# EAGLE design zLineIn_v.0.3a (EAGLE 6.5.0)
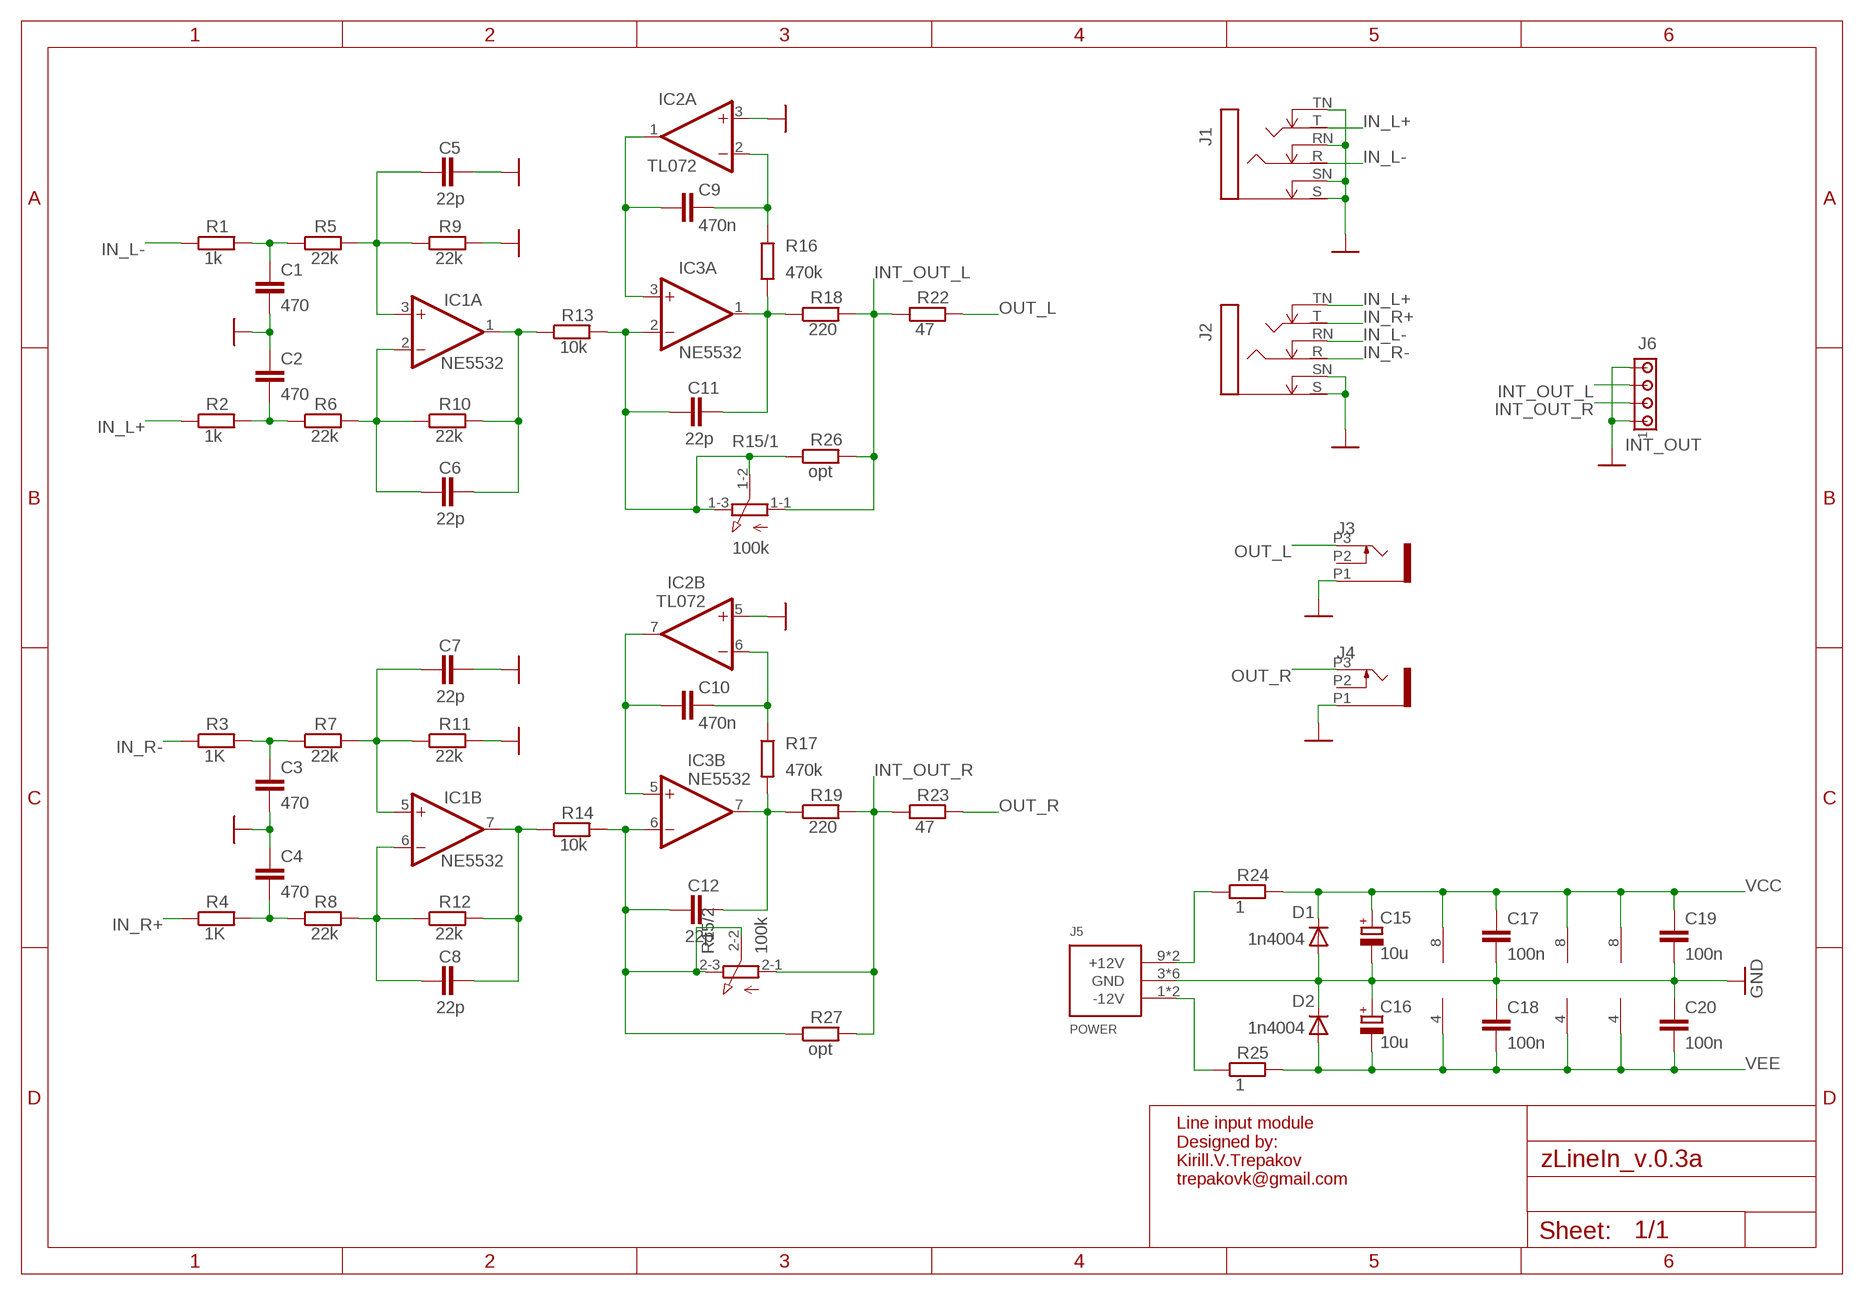
[diagram p0: schematic, sheet 1]

## Parts
C1  470  C-EU050-024X044  [C050-024X044]
C2  470  C-EU050-024X044  [C050-024X044]
C3  470  C-EU050-024X044  [C050-024X044]
C4  470  C-EU050-024X044  [C050-024X044]
C5  22p  C-EU050-024X044  [C050-024X044]
C6  22p  C-EU050-024X044  [C050-024X044]
C7  22p  C-EU050-024X044  [C050-024X044]
C8  22p  C-EU050-024X044  [C050-024X044]
C9  470n  C-EU075-032X103  [C075-032X103]
C10  470n  C-EU075-032X103  [C075-032X103]
C11  22p  C-EU050-024X044  [C050-024X044]
C12  22p  C-EU050-024X044  [C050-024X044]
C15  10u  CPOL-EUE2.5-5  [E2,5-5]
C16  10u  CPOL-EUE2.5-5  [E2,5-5]
C17  100n  C-EU050-024X044  [C050-024X044]
C18  100n  C-EU050-024X044  [C050-024X044]
C19  100n  C-EU050-024X044  [C050-024X044]
C20  100n  C-EU050-024X044  [C050-024X044]
D1  1n4004  1N4004"  [DO41-7.6]
D2  1n4004  1N4004"  [DO41-7.6]
IC1  NE5532  TL072P_  [DIL08_]
IC2  TL072  TL072P_  [DIL08_]
IC3  NE5532  TL072P_  [DIL08_]
J1  IN_L  STEREOSW1  [NMJ6HC-S]
J2  IN_R  STEREOSW1  [NMJ6HC-S]
J3  WQP-PJ302M_JACK  [WQP-PJ302M_JACK]
J4  WQP-PJ302M_JACK  [WQP-PJ302M_JACK]
J5  POWER  POWER_SIMPLE10  [POWER_10]
J6  INT_OUT  MTA04-100  [10X04MTA]
R1  1k  R-EU_0204/7  [0204/7]
R2  1k  R-EU_0204/7  [0204/7]
R3  1K  R-EU_0204/7  [0204/7]
R4  1K  R-EU_0204/7  [0204/7]
R5  22k  R-EU_0204/7  [0204/7]
R6  22k  R-EU_0204/7  [0204/7]
R7  22k  R-EU_0204/7  [0204/7]
R8  22k  R-EU_0204/7  [0204/7]
R9  22k  R-EU_0204/7  [0204/7]
R10  22k  R-EU_0204/7  [0204/7]
R11  22k  R-EU_0204/7  [0204/7]
R12  22k  R-EU_0204/7  [0204/7]
R13  10k  R-EU_0204/7  [0204/7]
R14  10k  R-EU_0204/7  [0204/7]
R15  100k  3RP/1610G  [3RP/1610G]
R16  470k  R-EU_0204/7  [0204/7]
R17  470k  R-EU_0204/7  [0204/7]
R18  220  R-EU_0204/7  [0204/7]
R19  220  R-EU_0204/7  [0204/7]
R22  47  R-EU_0204/7  [0204/7]
R23  47  R-EU_0204/7  [0204/7]
R24  1  R-EU_0204/7  [0204/7]
R25  1  R-EU_0204/7  [0204/7]
R26  opt  R-EU_0204/7  [0204/7]
R27  opt  R-EU_0204/7  [0204/7]

## Nets
CTRL_L_OUT: C11.2 IC3.1(A:OUT) R16.2 R18.1
CTRL_R_OUT: C12.2 IC3.7(B:OUT) R17.2 R19.1
GND: C1.2 C2.1 C3.2 C4.1 C5.2 C7.2 C15.- C16.+ C17.2 C18.1 C19.2 C20.1 D1.A D2.C IC2.3(A:+IN) IC2.5(B:+IN) J1.RN J1.S J1.SN J1.TN J2.S J2.SN J3.P1 J4.P1 J5.3(GND) J5.4(GND) J5.5(GND) J5.6(GND) J5.7(GND) J5.8(GND) J6.1 J6.4 R9.2 R11.2
IN_L+: J1.T J2.TN R2.1
IN_L-: J1.R J2.RN R1.1
IN_R+: J2.T R4.1
IN_R-: J2.R R3.1
INT_OUT_L: J6.3 R15.1-1 R18.2 R22.1 R26.2
INT_OUT_R: J6.2 R15.2-1 R19.2 R23.1 R27.2
N$2: J5.9(+12V) J5.10(+12V) R24.1
N$3: C9.2 IC2.2(A:-IN) R16.1
N$5: C10.2 IC2.6(B:-IN) R17.1
N$6: J5.1(-12V) J5.2(-12V) R25.1
N$7: C3.1 R3.2 R7.1
N$9: C4.2 R4.2 R8.1
N$17: C7.1 IC1.5(B:+IN) R7.2 R11.1
N$19: C1.1 R1.2 R5.1
N$20: C2.2 R2.2 R6.1
N$22: C5.1 IC1.3(A:+IN) R5.2 R9.1
N$23: C6.1 IC1.2(A:-IN) R6.2 R10.1
N$25: C8.1 IC1.6(B:-IN) R8.2 R12.1
OFFSET_L: C9.1 IC2.1(A:OUT) IC3.3(A:+IN)
OFFSET_R: C10.1 IC2.7(B:OUT) IC3.5(B:+IN)
OUT_L: J3.P3 R22.2
OUT_R: J4.P3 R23.2
UNBAL_L: C6.2 IC1.1(A:OUT) R10.2 R13.1
UNBAL_R: C8.2 IC1.7(B:OUT) R12.2 R14.1
VCC: C15.+ C17.1 C19.1 D1.C IC1.8(P:V+) IC2.8(P:V+) IC3.8(P:V+) R24.2
VEE: C16.- C18.2 C20.2 D2.A IC1.4(P:V-) IC2.4(P:V-) IC3.4(P:V-) R25.2
VGND_L: C11.1 IC3.2(A:-IN) R13.2 R15.1-2 R15.1-3 R26.1
VGND_R: C12.1 IC3.6(B:-IN) R14.2 R15.2-2 R15.2-3 R27.1
Unconnected: J3.P2 J4.P2

## Notes on the sheet
- Line input module
  Designed by:
  Kirill.V.Trepakov
  trepakovk@gmail.com

## Library data of the parts
C1-C12 C17-C20 = rcl:C-EU: CAPACITOR, European symbol
C15 C16 = rcl:CPOL-EU: POLARIZED CAPACITOR, European symbol
D1 D2 = _motovilo:1N4004: DIODE general purpose rectifier, 1 A
IC1-IC3 = _motovilo:TL072: OP AMP
J1 J2 = _motovilo:STEREOSW
J3 J4 = _motovilo:WQP-PJ302M_JACK
J5 = _motovilo:POWER_SIMPLE
J6 = con-amp:MTA04-100: AMP connector
R1-R14 R16-R19 R22-R27 = rcl:R-EU_: RESISTOR, European symbol
R15 = _motovilo:3RP/1610G: 16mm Potentiometer two level Source: http://www.alphapotentiometers.net/html/16mm_pot_2.html

## Board
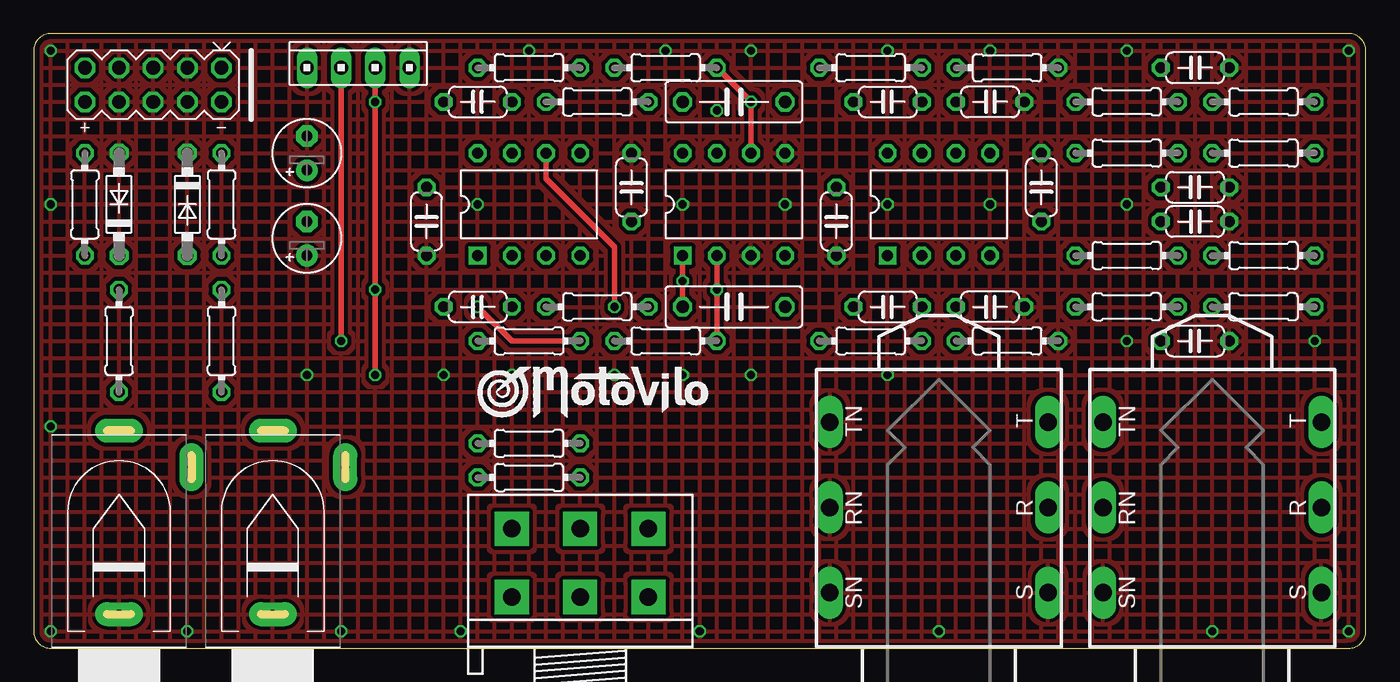
[diagram p1: board, top side]
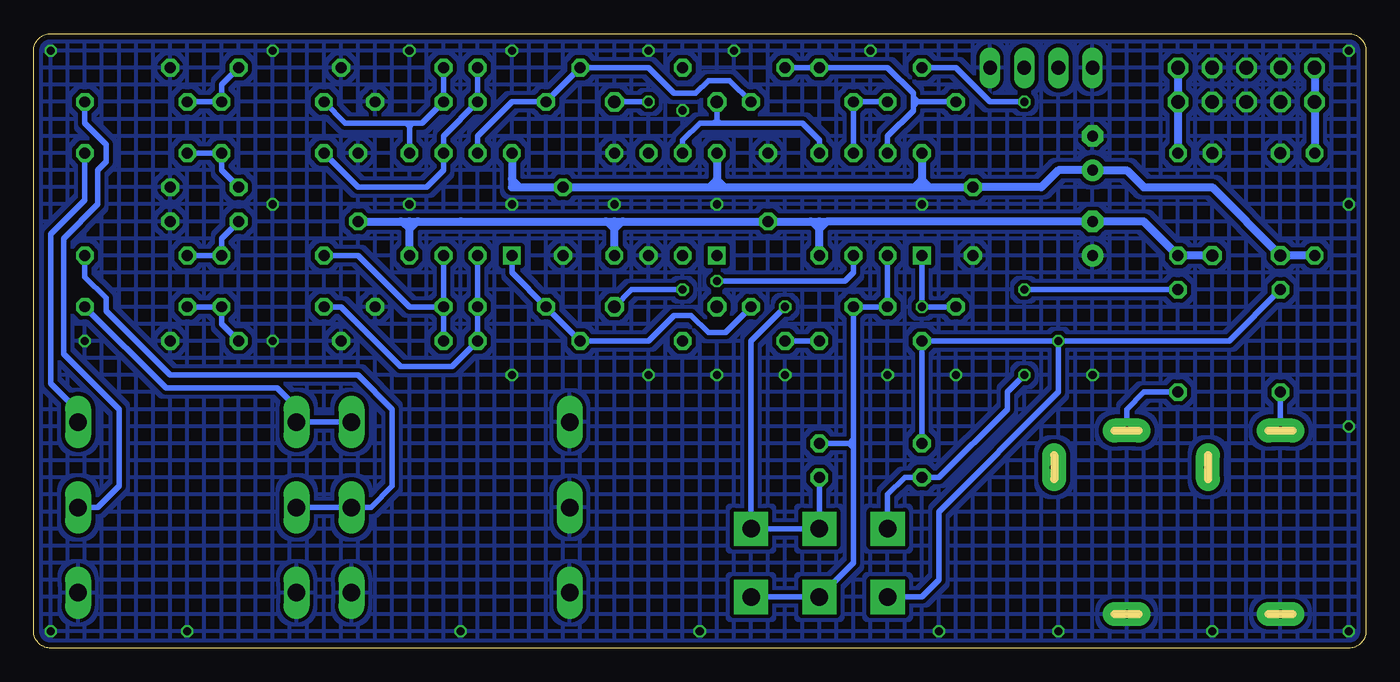
[diagram p2: board, bottom side, seen from below]

Size 99.06 x 45.72 mm. Coordinates in mm from the lower left corner, seen from the top.
Outline: 99.06,1.27 99.06,44.45 arc90 97.79,45.72 1.27,45.72 arc90 0,44.45 0,1.27 arc90 1.27,0 97.79,0 arc90 99.06,1.27
Copper layers (1*16): Top 0.035mm / dielectric 1.5mm / Bottom 0.035mm
Design rules "Motovilo Design Rules 12mil": minimum track width 12mil, minimum drill 12mil, track to track 12mil, track to pad 12mil, pad to pad 12mil, via to via 12mil, smd to smd 0mil, copper to edge 16mil, drill to drill 25mil, minimum pad ring 10mil, minimum via ring 6mil, stop-mask expansion 2mil, vias tented up to drill 100mil, thermal gap 10mil

### Footprints (pad centres in the part's own frame; a part is rotated, then mirrored left to right if it is on the bottom)
C050-024X044 = drill 0.813 octagon: 1 -2.54,0; 2 2.54,0
C075-032X103 = drill 0.914 octagon: 1 -3.81,0; 2 3.81,0
E2,5-5 = drill 0.813 pad 1.6: + -1.27,0 | drill 0.813 pad 1.6 octagon: - 1.27,0
DO41-7.6 = drill 0.9 octagon: A 3.81,0; C -3.81,0
DIL08_ = drill 0.813 square: 1 -3.81,-3.81 | drill 0.813 octagon: 2 -1.27,-3.81; 3 1.27,-3.81; 4 3.81,-3.81; 5 3.81,3.81; 6 1.27,3.81; 7 -1.27,3.81; 8 -3.81,3.81
NMJ6HC-S = drill 1.3 long: R 0,8.115; RN 0,-8.115; S 6.35,8.115; SN 6.35,-8.115; T -6.35,8.115; TN -6.35,-8.115
WQP-PJ302M_JACK = drill 0.61 pad 1.778 long: P1 0,-5.08; P2 5.397,5.842; P3 0,8.572
POWER_10 = drill 1.016 octagon: 1 1.27,-5.08; 2 -1.27,-5.08; 3 1.27,-2.54; 4 -1.27,-2.54; 5 1.27,0; 6 -1.27,0; 7 1.27,2.54; 8 -1.27,2.54; 9 1.27,5.08; 10 -1.27,5.08
10X04MTA = drill 1.016 long: 1 3.81,0; 2 1.27,0; 3 -1.27,0; 4 -3.81,0
0204/7 = drill 0.813 octagon: 1 -3.81,0; 2 3.81,0
3RP/1610G = drill 1.3 pad 2.54 square: 1-1 -5.08,0; 1-2 0,0; 1-3 5.08,0; 2-1 -5.08,5.08; 2-2 0,5.08; 2-3 5.08,5.08

### Placement (x,y rotation side)
C1  86.36,31.75 0 top
C2  86.36,22.86 180 top
C3  86.36,43.18 0 top
C4  86.36,34.29 180 top
C5  71.12,25.4 0 top
C6  63.5,25.4 180 top
C7  71.12,40.64 0 top
C8  63.5,40.64 180 top
C9  52.07,25.4 0 top
C10  52.07,40.64 0 top
C11  33.02,25.4 180 top
C12  33.02,40.64 180 top
C15  20.32,36.83 90 top
C16  20.32,30.48 90 top
C17  59.69,31.75 270 top
C18  74.93,34.29 270 top
C19  29.21,31.75 270 top
C20  44.45,34.29 270 top
D1  6.35,33.02 90 top
D2  11.43,33.02 270 top
IC1  67.31,33.02 0 top
IC2  52.07,33.02 0 top
IC3  36.83,33.02 0 top
J1  67.31,10.48 270 top
J2  87.63,10.48 270 top
J3  6.35,7.62 0 top
J4  17.78,7.62 0 top
J5  8.89,41.91 90 top
J6  24.13,43.18 0 top
R1  91.44,29.21 180 top
R2  91.44,25.4 180 top
R3  91.44,40.64 180 top
R4  91.44,36.83 180 top
R5  81.28,29.21 180 top
R6  81.28,25.4 180 top
R7  81.28,40.64 180 top
R8  81.28,36.83 180 top
R9  72.39,22.86 0 top
R10  62.23,22.86 180 top
R11  72.39,43.18 0 top
R12  62.23,43.18 180 top
R13  41.91,25.4 180 top
R14  41.91,40.64 180 top
R15  40.64,3.81 0 top
R16  46.99,22.86 180 top
R17  46.99,43.18 180 top
R18  36.83,22.86 180 top
R19  36.83,43.18 180 top
R22  6.35,22.86 270 top
R23  13.97,22.86 270 top
R24  3.81,33.02 270 top
R25  13.97,33.02 270 top
R26  36.83,15.24 180 top
R27  36.83,12.7 180 top
U$2  [LOGO_SPACE_002]  33.02,17.14 0 top

### Tracks (layer width: path | path; a pad name or v marks a point on that pad's centre or on a via)
CTRL_L_OUT  (via drill 0.6)
  Top 0.406: R18.1 35.56,22.86 v33.02,25.4
  Bottom 0.406: R18.1 R16.2 | C11.2 v33.02,25.4 IC3.1
CTRL_R_OUT
  Bottom 0.406: R17.2 R19.1 35.56,43.18 33.66,41.27 33.66,40.96 | IC3.7 35.56,38.1 33.66,40.01 33.66,40.32 | 33.66,40.32 33.66,40.64 | 33.66,40.64 33.66,40.96 | C12.2 33.34,40.64 | 33.34,40.64 33.66,40.64 | 33.34,40.64 33.66,40.32 | 33.34,40.64 33.66,40.96
GND  (via drill 0.6)
  other vias: 97.79,44.45 81.28,44.45 53.34,44.45 50.8,40.01 71.12,44.45 63.5,44.45 46.99,44.45 36.83,44.45 1.27,1.27 1.27,16.51 1.27,33.02 11.43,1.27 22.86,1.27 31.75,1.27 49.53,1.27 87.63,1.27 67.31,1.27 97.79,1.27 33.02,33.02 48.26,33.02 55.88,33.02 63.5,33.02 71.12,33.02 30.48,20.32 43.18,20.32 48.26,20.32 35.56,20.32 20.32,20.32 53.34,20.32 81.28,33.02 1.27,44.45 81.28,22.86 95.25,22.86 63.5,20.32
  pour Top (isolate 0.305, hatched): 0,45.72 99.06,45.72 99.06,0 0,0
  pour Bottom (isolate 0.305, hatched): 0,0 99.06,0 99.06,45.72 0,45.72
IN_L+
  Bottom 0.406: R2.1 89.22,19.37 80.96,19.37 79.52,17.92 J2.TN J1.T
IN_L-
  Bottom 0.406: J2.RN J1.R 73.98,10.48 72.39,12.06 72.39,17.78 74.93,20.32 88.9,20.32 93.66,25.08 93.66,26.04 95.25,27.62 R1.1
IN_R+
  Bottom 0.406: J2.T 95.75,17.64 97.79,19.68 97.79,30.8 95.25,33.34 R4.1
IN_R-
  Bottom 0.406: J2.R 94.3,10.48 92.71,12.06 92.71,17.78 96.84,21.91 96.84,30.48 94.3,33.02 94.3,35.56 93.66,36.2 93.66,37.47 95.25,39.05 R3.1
INT_OUT_L  (via drill 0.6)
  Top 0.406: J6.3 v22.86,22.86
  Bottom 0.406: v22.86,22.86 R18.2 R26.2 | v22.86,22.86 10.16,22.86 R22.1 | R15.1-1 33.02,3.81 31.75,5.08 31.75,10.16 22.86,19.05 v22.86,22.86
INT_OUT_R  (via drill 0.6)
  Top 0.406: J6.2 v25.4,40.64 v25.4,26.67 v25.4,20.32
  Bottom 0.406: v25.4,26.67 R23.1 | R19.2 30.48,43.18 27.94,40.64 v25.4,40.64 | R15.2-1 35.56,11.43 34.29,12.7 R27.2 31.75,12.7 26.67,17.78 26.67,19.05 v25.4,20.32
N$2
  Bottom 0.61: J5.9 J5.10 R24.1
N$3  (via drill 0.6)
  Top 0.406: IC2.2 v50.8,26.67 R16.1
  Bottom 0.406: C9.2 54.61,26.67 v50.8,26.67
N$5  (via drill 0.6)
  Top 0.406: R17.1 v53.34,40.64 IC2.6
  Bottom 0.406: C10.2 v53.34,40.64
N$6
  Bottom 0.61: J5.1 J5.2 R25.1
N$7
  Bottom 0.406: R3.2 R7.1 85.09,41.91 C3.1
N$9
  Bottom 0.406: R4.2 R8.1 85.09,35.56 C4.2
N$17
  Bottom 0.305: 70.8,39.05 71.12,38.73 71.44,39.05
  Bottom 0.406: R11.1 C7.1 70.17,39.05 70.8,39.05 71.12,39.05 | 71.12,39.05 71.44,39.05 75.88,39.05 R7.2 | IC1.5 71.12,38.73 71.12,39.05
N$19
  Bottom 0.406: R1.2 R5.1 85.09,30.48 C1.1
N$20
  Bottom 0.406: R2.2 R6.1 85.09,24.13 C2.2
N$22
  Bottom 0.406: R9.1 C5.1 | R5.2 74.93,29.21 71.12,25.4 C5.1 | IC1.3 C5.1
N$23
  Bottom 0.406: IC1.2 C6.1 R10.1 67.94,20.95 71.75,20.95 76.2,25.4 R6.2
N$25
  Bottom 0.406: R12.1 C8.1 68.58,38.1 IC1.6 68.58,35.56 69.85,34.29 74.93,34.29 R8.2
OFFSET_L  (via drill 0.6)
  Top 0.406: IC2.1 v48.26,27.3 C9.1
  Bottom 0.406: IC3.3 38.1,27.94 38.73,27.3 v48.26,27.3
OFFSET_R
  Bottom 0.305: 47.94,39.05 48.26,39.37 48.58,39.05
  Bottom 0.406: IC3.5 40.64,37.78 41.91,39.05 47.94,39.05 48.26,39.05 | 48.26,39.05 48.58,39.05 49.53,39.05 50.8,37.78 IC2.7 | C10.1 48.26,39.37 48.26,39.05
OUT_L
  Bottom 0.406: J3.P3 R22.2
OUT_R
  Bottom 0.406: J4.P3 17.78,17.78 16.51,19.05 R23.2
UNBAL_L
  Bottom 0.406: IC1.1 63.5,27.94 C6.2 R10.2 53.34,22.86 51.44,24.77 50.16,24.77 48.9,23.5 47.62,23.5 R13.1
UNBAL_R
  Bottom 0.406: IC1.7 66.04,38.1 63.5,40.64 C8.2 R12.2 53.34,43.18 51.44,41.27 49.85,41.27 48.9,42.23 47.31,42.23 R14.1
VCC
  Bottom 0.406: 48.9,34.29 48.26,34.92 47.62,34.29 | 32.38,34.29 33.02,34.92 33.66,34.29 | 63.5,34.92 62.87,34.29
  Bottom 0.61: IC1.8 63.5,34.92 63.5,34.29 62.87,34.29 C17.1 48.9,34.29 48.26,34.29 | 48.26,34.29 47.62,34.29 33.66,34.29 33.02,34.29 | 33.02,34.29 32.38,34.29 C19.1 24.13,34.29 22.86,35.56 C15.+ 17.78,35.56 16.51,34.29 11.43,34.29 D1.C R24.2 | IC2.8 48.26,34.92 48.26,34.29 | IC3.8 33.02,34.92 33.02,34.29
VEE
  Bottom 0.406: 71.75,31.75 71.12,31.11 70.48,31.75 | 55.24,31.75 55.88,31.11 56.52,31.75 | 41.27,31.75 40.64,31.11 40.01,31.75
  Bottom 0.61: C18.2 71.75,31.75 71.12,31.75 | 71.12,31.75 70.48,31.75 67.31,31.75 56.52,31.75 55.88,31.75 | 55.88,31.75 55.24,31.75 C20.2 41.27,31.75 40.64,31.75 | IC2.4 55.88,31.11 55.88,31.75 | IC1.4 71.12,31.11 71.12,31.75 | 40.64,31.75 40.01,31.75 36.83,31.75 C16.- 16.51,31.75 R25.2 D2.A | IC3.4 40.64,31.11 40.64,31.75
VGND_L
  Bottom 0.406: IC3.2 C11.1 R13.2 38.1,15.56 | 38.1,14.92 38.1,6.35 R15.1-2 R15.1-3 | 38.1,14.92 38.1,15.24 | 38.1,15.24 38.1,15.56 | 38.42,15.24 38.1,15.24 | 38.42,15.24 38.1,15.56 | 38.42,15.24 38.1,14.92 | R26.1 38.42,15.24
VGND_R  (via drill 0.6)
  Top 0.406: v43.18,25.4 43.18,29.84 38.1,34.92 IC3.6
  Bottom 0.406: C12.1 R14.2 IC3.6 | v43.18,25.4 45.72,22.86 R15.2-3 R15.2-2 R27.1

### Text on the board
tDocu: zLINEIN v.0.3a